# EasyEDA Pro project OSC1.eprj, board CH1/2
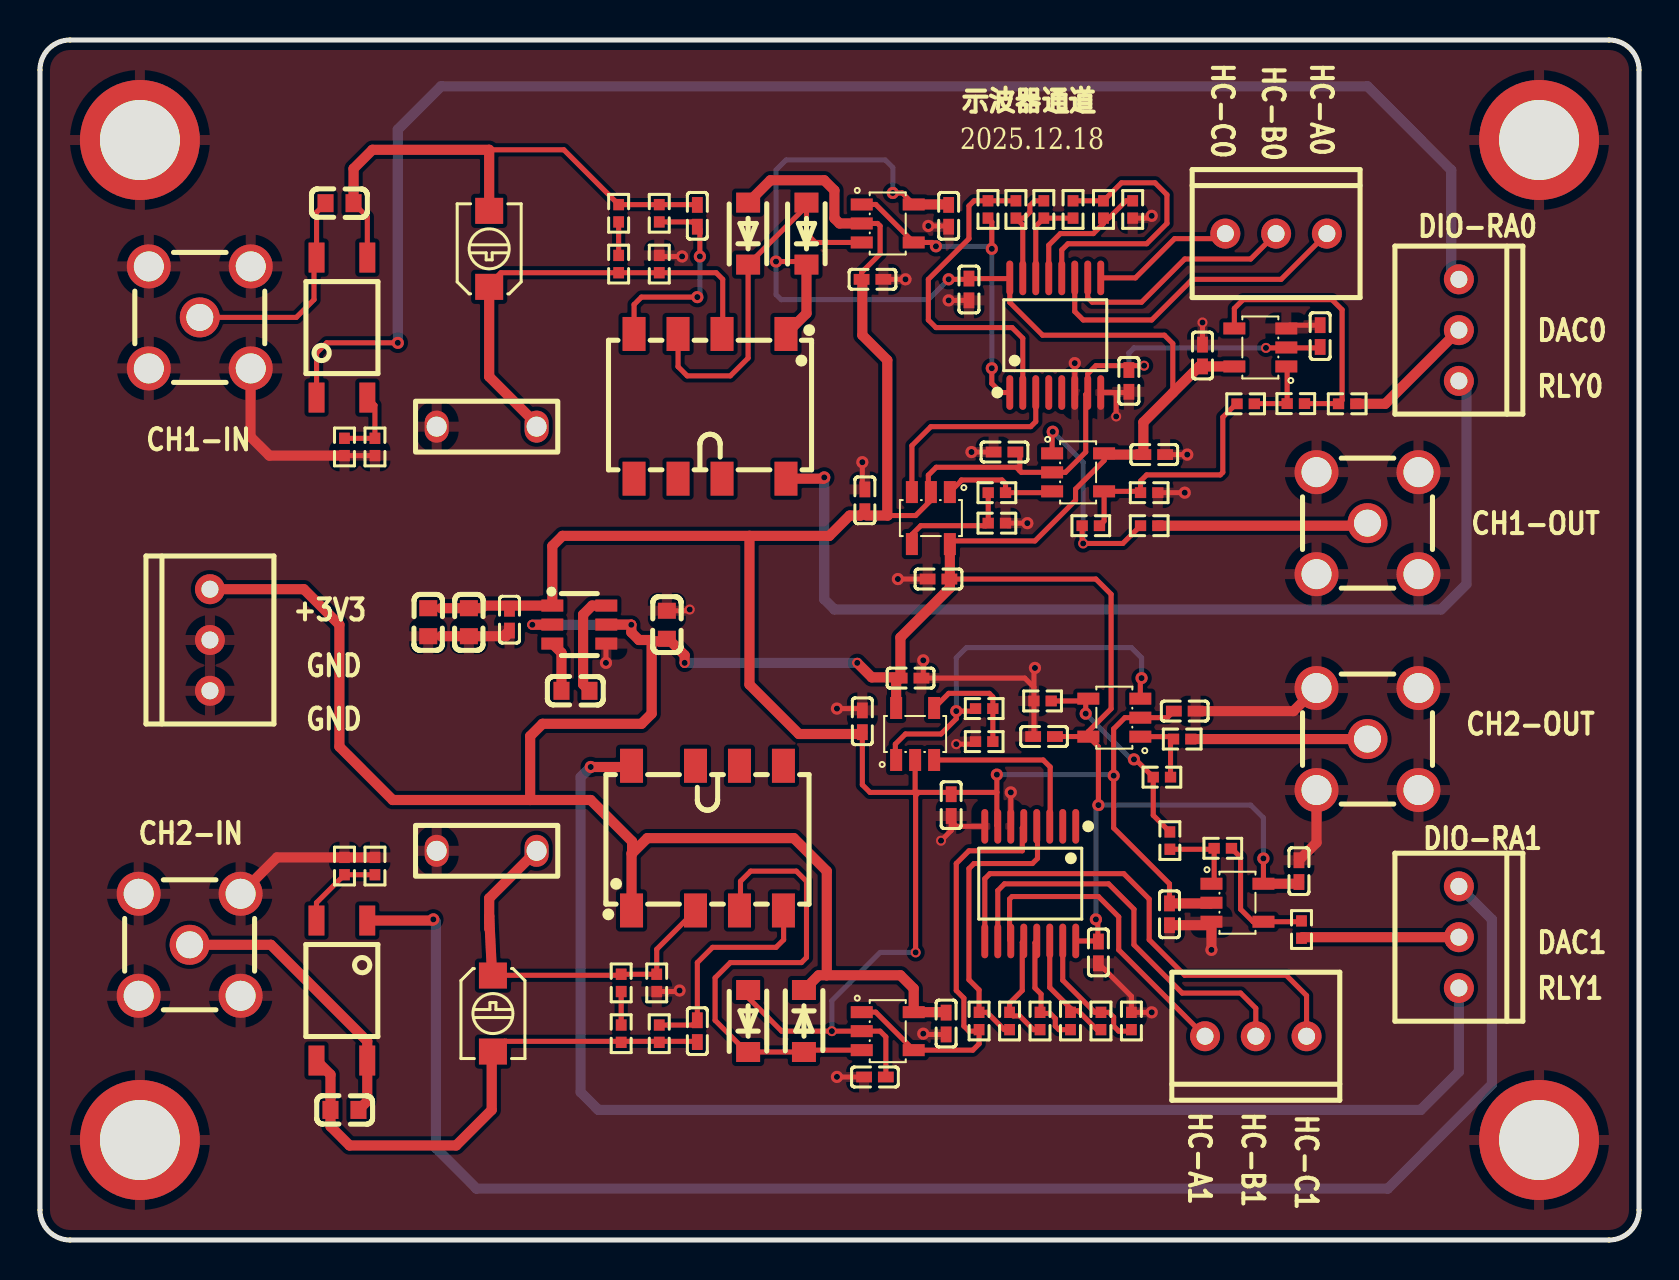
[diagram p11: board, top side]
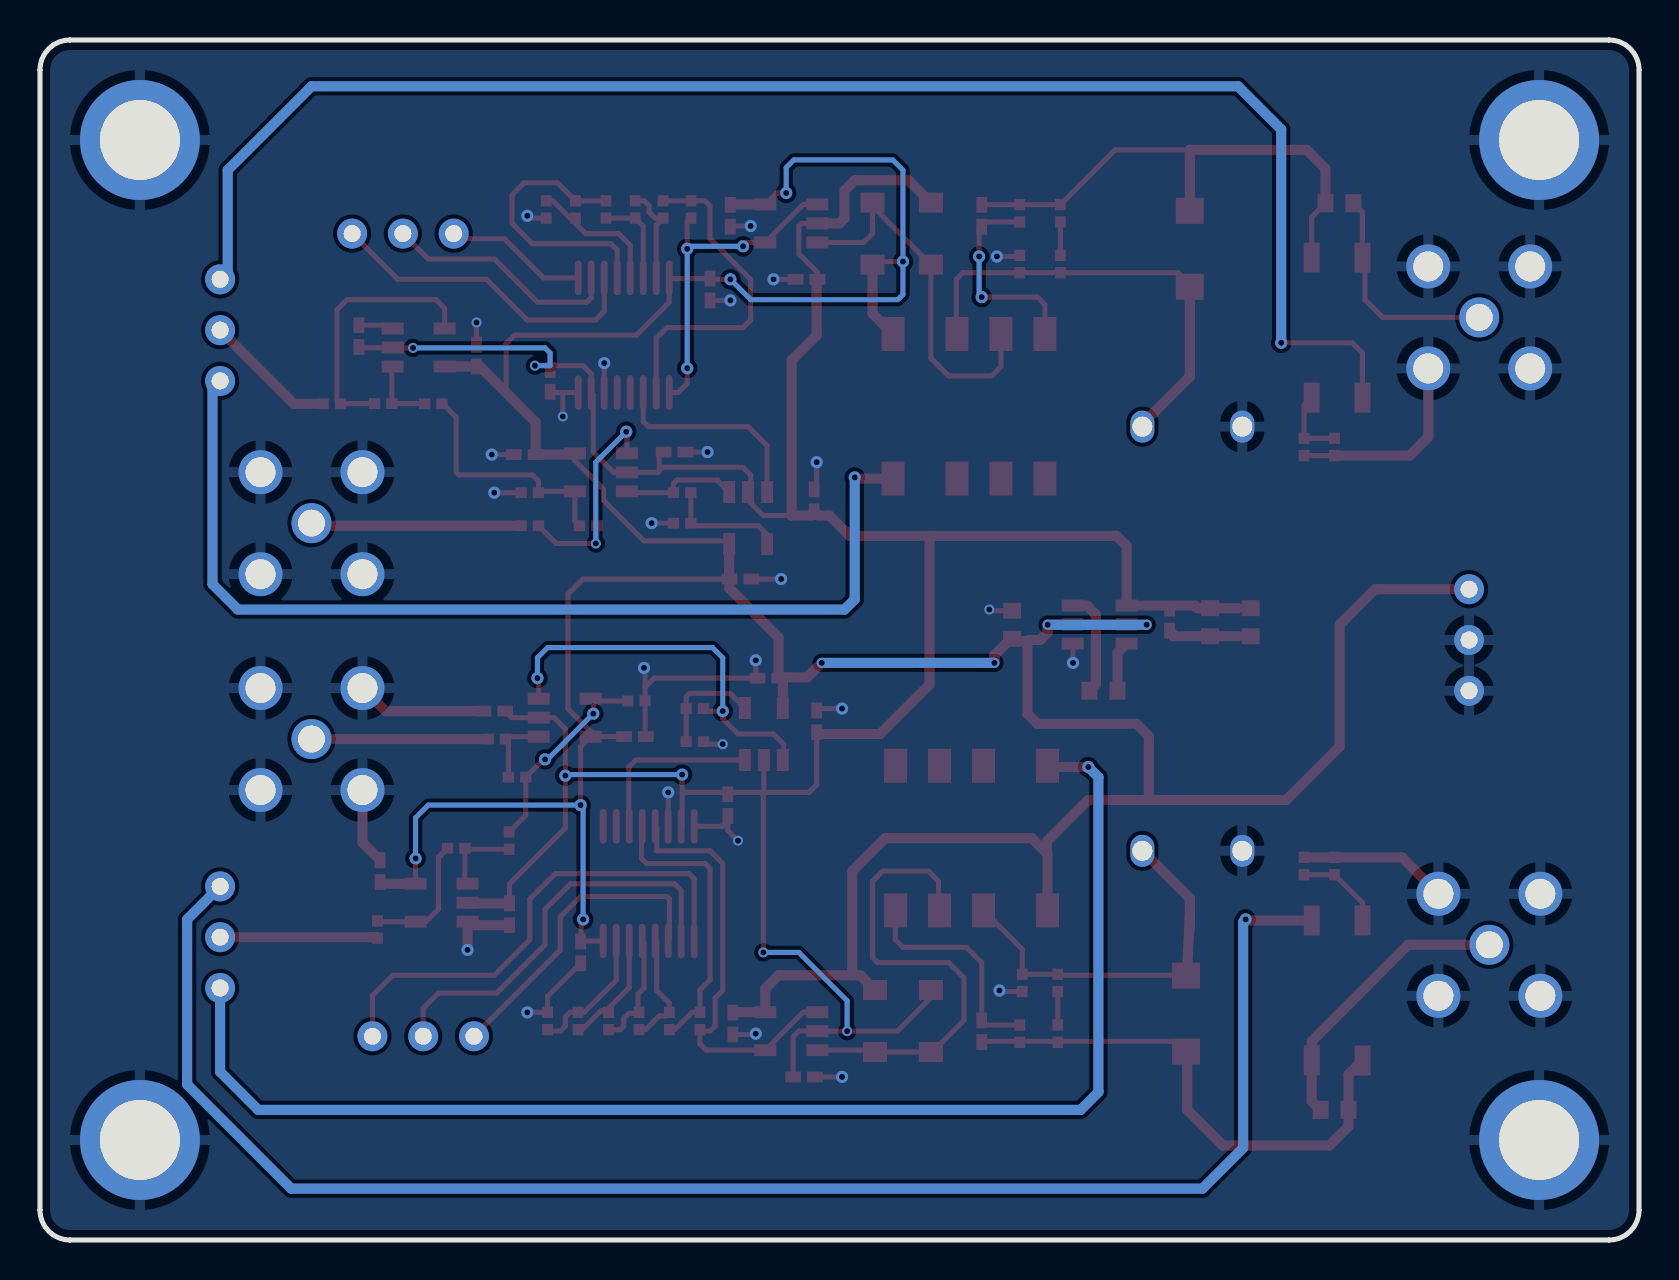
[diagram p12: board, bottom side, seen from below]

Outline 80 x 60 mm; copper layers: Top Layer, Bottom Layer. Coordinates in mm from the lower left corner of the outline.
Outline path: 0,58.5 0,1.5 arc(0.44,0.44) 1.5,0 78.5,0 arc(79.56,0.44) 80,1.5 80,58.5 arc(79.56,59.56) 78.5,60 1.5,60 arc(0.44,59.56) 0,58.5
Stack: Top Layer 0.035mm / Dielectric1 1.51mm FR4 er 4.5 / Bottom Layer 0.035mm

## Design rules (mm)
template: 自定义配置
spacing copperThickness1oz (default): track to track 0.203, other pairs 0.203 to 0.203
spacing copperThickness2oz: track to track 0.203, other pairs 0.152 to 0.3
track width copperThickness1oz (default): min 0.127, default 0.254, max 2.54
track width copperThickness2oz: min 0.203, default 0.254, max 2.54
track width trackWidth1: min 0.254, default 0.762, max 2.54
differential pair differentialPair (default): width min 0.127, default 0.254, max 2.54; gap min 0.152, default 0.152
via viaSize (default): diameter min 0.5, default 0.61, max 10; hole min 0.3, default 0.305, max 6.299

## Placement (name value [footprint] x y rotation side)
C1  22nF  [C0603]  14.99 51.84 0 top
C2  100nF  [C0402]  41.65 48.03 0 top
C3  10nF  [C0402]  32.89 51.21 270 top
C4  120P  [280*100mil]  22.35 40.67 0 top
C5  100nF  [C0402]  45.46 51.21 270 top
C6  100nF  [C0402]  46.48 47.53 90 top
C7  100nF  [C0402]  41.27 36.98 90 top
C8  100nF  [C0402]  48.25 39.4 180 top
C9  100nF  [C0402]  54.48 42.95 90 top
C10  100nF  [C0402]  64.05 45.2 90 top
C11  100nF  [C0402]  44.95 33.05 180 top
C12  100nF  [C0402]  55.75 39.27 0 top
C13  100nF  [C0402]  58.16 44.22 90 top
C14  22nF  [C0603]  15.23 6.5 180 top
C15  100nF  [C0402]  41.77 8.15 180 top
C16  10nF  [C0402]  32.89 10.44 90 top
C17  120P  [280*100mil]  22.35 19.46 0 top
C18  100nF  [C0402]  45.33 10.82 270 top
C19  100nF  [C0402]  52.95 14.38 90 top
C20  100nF  [C0402]  41.14 25.94 90 top
C21  100nF  [C0402]  57.27 26.44 0 top
C22  100nF  [C0402]  45.59 21.74 90 top
C23  100nF  [C0402]  56.51 16.28 270 top
C24  100nF  [C0402]  43.56 28.09 0 top
C25  100nF  [C0402]  50.23 25.17 180 top
C26  100nF  [C0402]  62.99 18.44 90 top
C27  22uF  [C0603]  21.46 30.89 90 top
C28  22uF  [C0603]  19.43 30.89 90 top
C29  22uF  [C0603]  31.36 30.76 270 top
C30  100nF  [C0402]  23.49 31.02 90 top
C31  3.3uF  [C0603]  26.79 27.46 0 top
C32  STC3MA06-T1  [CAP-SMD_L4.5-W3.2_STC3MD20-T1]  22.47 49.56 90 top
C33  STC3MA06-T1  [CAP-SMD_L4.5-W3.2_STC3MD20-T1]  22.66 11.32 270 top
D1  SM4007PL  [SOD-123F_L2.8-W1.8-LS3.7-RD]  35.43 50.32 90 top
D2  SM4007PL  [SOD-123F_L2.8-W1.8-LS3.7-RD]  38.35 50.32 90 top
D3  SM4007PL  [SOD-123F_L2.8-W1.8-LS3.7-RD]  35.43 10.95 90 top
D4  SM4007PL  [SOD-123F_L2.8-W1.8-LS3.7-RD]  38.22 10.95 270 top
J1  -  [CH2.54-3插座]  70.99 45.49 270 top
J2  -  [CH2.54-3插座]  61.84 50.32 0 top
J3  -  [CH2.54-3插座]  70.99 15.14 270 top
J4  -  [CH2.54-3插座]  60.83 10.19 180 top
J5  -  [CH2.54-3插座]  8.5 30 90 top
K1  G6K-2F-Y DC3  [RELAY-SMD_G6K-2F-Y]  33.52 41.68 180 top
K2  G6K-2F-Y DC3  [RELAY-SMD_G6K-2F-Y]  33.4 20.09 0 top
NOREF  -  [Pad_e858]  5 5 0 top
NOREF#2  -  [Pad_e849]  75 55 0 top
NOREF#3  -  [Pad_e1140]  5 55 0 top
NOREF#4  -  [Pad_e850]  75 5 0 top
R1  510kΩ  [R0402]  30.98 51.34 90 top
R2  510kΩ  [R0402]  28.95 51.34 90 top
R3  470kΩ  [R0402]  28.95 48.8 90 top
R4  49.9Ω  [R0402]  47.43 51.53 90 top
R5  24.9Ω  [R0402]  48.83 51.53 270 top
R6  4.99Ω  [R0402]  50.22 51.53 270 top
R7  10Ω  [R0402]  51.68 51.53 90 top
R8  4.99Ω  [R0402]  53.21 51.53 270 top
R9  4.99Ω  [R0402]  54.67 51.53 270 top
R10  20kΩ  [R0402]  30.98 48.8 270 top
R11  1kΩ  [R0402]  15.23 39.65 90 top
R12  1kΩ  [R0402]  16.76 39.65 90 top
R13  22Ω  [R0402]  55.49 35.72 0 top
R14  82Ω  [R0402]  47.87 35.84 180 top
R15  180Ω  [R0402]  47.87 37.37 0 top
R16  180Ω  [R0402]  55.49 37.37 180 top
R17  220Ω  [R0402]  52.57 35.72 180 top
R18  220Ω  [R0402]  60.32 41.81 180 top
R19  220Ω  [R0402]  65.4 41.81 180 top
R20  220Ω  [R0402]  62.83 41.82 180 top
R21  510kΩ  [R0402]  30.98 10.31 270 top
R22  510kΩ  [R0402]  29.08 10.31 270 top
R23  470kΩ  [R0402]  29.08 12.86 270 top
R24  49.9Ω  [R0402]  46.98 10.95 90 top
R25  24.9Ω  [R0402]  48.51 10.95 90 top
R26  4.99Ω  [R0402]  50.03 10.95 90 top
R27  10Ω  [R0402]  51.56 10.95 90 top
R28  4.99Ω  [R0402]  53.08 10.95 90 top
R29  4.99Ω  [R0402]  54.61 10.95 90 top
R30  20kΩ  [R0402]  30.86 12.86 90 top
R31  1kΩ  [R0402]  15.23 18.7 270 top
R32  1kΩ  [R0402]  16.76 18.7 270 top
R33  22Ω  [R0402]  57.14 25.05 0 top
R34  82Ω  [R0402]  47.24 24.92 0 top
R35  180Ω  [R0402]  47.24 26.57 180 top
R36  180Ω  [R0402]  50.16 26.95 0 top
R37  220Ω  [R0402]  56.13 23.14 0 top
R38  220Ω  [R0402]  56.53 19.97 90 top
R39  220Ω  [R0402]  63.11 15.52 90 top
R40  220Ω  [R0402]  59.18 19.59 180 top
RF1  BWSMA-KE-Z001  [SMA-TH_BWSMA-KE-Z001]  8 46.13 0 top
RF2  BWSMA-KE-Z001  [SMA-TH_BWSMA-KE-Z001]  66.42 35.84 180 top
RF3  BWSMA-KE-Z001  [SMA-TH_BWSMA-KE-Z001]  7.49 14.76 0 top
RF4  BWSMA-KE-Z001  [SMA-TH_BWSMA-KE-Z001]  66.42 25.05 0 top
U2  TLP172GM(TPL,E(O  [SMD-4_L4.6-W3.7-P2.54-LS7.0-BR]  15.11 45.62 270 top
U3  GS8091-TR  [SOT-23-5_L3.0-W1.7-P0.95-LS2.8-BR]  42.41 50.83 180 top
U4  74HC4051PW,118  [TSSOP-16_L5.0-W4.4-P0.65-LS6.4-BL]  50.8 45.24 0 top
U5  GS8091-TR  [SOT-23-5_L3.0-W1.7-P0.95-LS2.8-BR]  44.57 36.1 90 top
U6  GS8091-TR  [SOT-23-5_L3.0-W1.7-P0.95-LS2.8-BR]  51.94 38.38 180 top
U7  GS8091-TR  [SOT-23-5_L3.0-W1.7-P0.95-LS2.8-BR]  61.05 44.63 0 top
U9  TLP172GM(TPL,E(O  [SMD-4_L4.6-W3.7-P2.54-LS7.0-BR]  15.1 12.47 90 top
U10  GS8091-TR  [SOT-23-5_L3.0-W1.7-P0.95-LS2.8-BR]  42.41 10.44 180 top
U11  74HC4051PW,118  [TSSOP-16_L5.0-W4.4-P0.65-LS6.4-BL]  49.54 17.82 180 top
U12  GS8091-TR  [SOT-23-5_L3.0-W1.7-P0.95-LS2.8-BR]  43.78 25.3 270 top
U13  GS8091-TR  [SOT-23-5_L3.0-W1.7-P0.95-LS2.8-BR]  53.75 26.12 0 top
U14  GS8091-TR  [SOT-23-5_L3.0-W1.7-P0.95-LS2.8-BR]  59.91 16.86 180 top
U15  SGM3204YN6G/TR  [SOT-23-6_L2.9-W1.6-P0.95-LS2.8-BR]  26.98 30.77 180 top

## Footprints (pads in the part's own frame, mm; a bottom-side part is the same pattern mirrored in y, then rotated)
280*100mil
  oval 1.2x1.6 hole 1x0.8: 1(-2.5,0) 2(2.5,0)
C0402
  rect 0.79x0.54 smd: 1(-0.545,0) 2(0.545,0)
C0603
  rect 0.8x0.9 smd: 1(-0.7,0) 2(0.7,0)
CAP-SMD_L4.5-W3.2_STC3MD20-T1
  rect 1.3x1.4 smd: 1(-1.9,0) 2(1.9,0)
CH2.54-3插座
  round 1.5 hole 0.85: 1(-2.54,0) 2(0,0) 3(2.54,0)
Pad_e849
  round 6 hole 4: 2(0,0)
Pad_e850
  round 6 hole 4: 4(0,0)
Pad_e858
  round 6 hole 4: 3(0,0)
Pad_e1140
  round 6 hole 4: 1(0,0)
R0402
  rect 0.566x0.54 smd: 1(-0.433,0) 2(0.433,0)
RELAY-SMD_G6K-2F-Y
  rect 1.15x1.7 smd: 1(-3.8,-3.618) 2(-0.6,-3.618) 3(1.6,-3.618) 4(3.8,-3.618) 5(3.8,3.618) 6(1.6,3.618) 7(-0.6,3.618) 8(-3.8,3.618)
SMA-TH_BWSMA-KE-Z001
  round 2.2 hole 1.5: 1(-2.55,-2.55) 2(-2.55,2.55) 3(2.55,2.55) 4(2.55,-2.55)
  round 2 hole 1.35: 5(0,0)
SMD-4_L4.6-W3.7-P2.54-LS7.0-BR
  rect 1.5x0.8 smd: 1(3.5,-1.27) 2(3.5,1.27) 3(-3.5,1.27) 4(-3.5,-1.27)
SOD-123F_L2.8-W1.8-LS3.7-RD
  rect 1x1.2 smd: 1(-1.55,0) 2(1.55,0)
SOT-23-5_L3.0-W1.7-P0.95-LS2.8-BR
  rect 1.1x0.6 smd: 1(1.3,-0.95) 2(1.3,0) 3(1.3,0.95) 4(-1.3,0.95) 5(-1.3,-0.95)
SOT-23-6_L2.9-W1.6-P0.95-LS2.8-BR
  rect 1.1x0.6 smd: 1(1.35,-0.95) 2(1.35,0) 3(1.35,0.95) 4(-1.35,0.95) 5(-1.35,0) 6(-1.35,-0.95)
TSSOP-16_L5.0-W4.4-P0.65-LS6.4-BL
  oval 0.343x1.732 smd: 1(-2.275,-2.866) 2(-1.625,-2.866) 3(-0.975,-2.866) 4(-0.325,-2.866) 5(0.325,-2.866) 6(0.975,-2.866) 7(1.625,-2.866) 8(2.275,-2.866) 9(2.275,2.866) 10(1.625,2.866) 11(0.975,2.866) 12(0.325,2.866) 13(-0.325,2.866) 14(-0.975,2.866) 15(-1.625,2.866) 16(-2.275,2.866)

## Nets
As in the schematic, except:
GND: C2.2 C4.1 C5.2 C6.1 C7.2 C8.2 C9.1 C10.2 C11.2 C12.2 C13.2 C15.2 C17.1 C18.2 C19.1 C20.2 C21.2 C22.1 C23.2 C24.2 C25.2 C26.2 C27.1 C28.1 C29.1 C30.1 J5.1 J5.2 NOREF.3 NOREF#2.2 NOREF#3.1 NOREF#4.4 R9.2 R10.1 R11.1 R12.1 R14.1 R16.1 R29.2 R30.1 R31.1 R32.1 R34.1 R36.1 RF1.1 RF1.2 RF1.3 RF1.4 RF2.1 RF2.2 RF2.3 RF2.4 RF3.1 RF3.2 RF3.3 RF3.4 RF4.1 RF4.2 RF4.3 RF4.4 U4.6 U4.8 U7.3 U11.6 U11.8 U14.3 U15.4
INPUT1: C1.1 RF1.5 U2.4
INPUT2: C14.1 RF3.5 U9.4

Pads without a net: K1 5 6 7; K2 5 6 7; U4 4 5; U11 1 2

## Via types
v1: diameter 0.61, hole 0.305, Top Layer to Bottom Layer, 44 vias
v2: diameter 0.5, hole 0.305, Top Layer to Bottom Layer, 13 vias
v3: diameter 0.51, hole 0.305, Top Layer to Bottom Layer, 1 via

## Routing (per net, layer and track width the routed paths; a pad name or vN(x,y) marks a point on that pad's centre or on a via; arc(x,y) is an arc through that point)
+3V3: length 212.9
  Top Layer w0.254: 45.52,33.05 52.83,33.05 53.59,32.29 53.59,26.56 52.45,25.42 U13.5 ; U14.5 61.21,19.08 ; v1(45.46,48.03) 46.44,48.03 C6.2 48.49,48.07 U4.16 48.52,46.88 50.16,45.24 56.26,45.24 56.68,44.82 56.68,42.36 ; 30.54,30 30.6,30.06 ; v1(42.67,52.35) 43.14,52.35 U3.5 ; 51.82,14.95 52.93,14.95 ; 52.93,14.95 C19.2 ; 52.93,14.95 52.93,15.93 v1(52.83,16.03) ; U13.5 52.44,25.17 C25.1 ; U13.5 52.95,24.66 v1(52.95,21.74) ; v1(36.83,48.92) 38.2,48.92 D2.1 ; v2(24.63,30.76) 24.62,30.77 24.52,30.77 ; U5.5 45.68,34.95 49.78,34.95 51.81,36.98 51.81,37.55 53.24,38.97 U6.5
  Top Layer w0.508: U14.5 62.9,17.81 C26.1 ; 39.36,13.24 43.05,13.24 43.71,12.57 U10.5 45.31,11.39 C18.1 ; 39.36,13.24 39.36,13.24 39.36,18.44 37.71,20.09 30.39,20.09 29.62,19.33 ; 39.36,13.24 38.96,13.24 D4.1 ; U15.2 25.62,30.76 v2(24.63,30.76) ; 24.52,22 17.65,22 14.98,24.67 14.98,30.76 13.2,32.54 J5.3 ; 24.52,22 24.52,25.19 25.14,25.81 30.09,25.81 30.6,26.32 30.6,29.94 ; 24.52,22 27.55,22 29.62,19.93 29.62,19.33 ; 30.6,29.94 31.55,29.94 32.25,29.24 v2(32.25,28.86) ; 30.6,29.94 30.54,30 29.97,30 29.59,30.38 v2(29.59,30.76) 29.58,30.77 U15.5 ; D2.1 38.35,46.33 K1.1 ; C11.1 45.52,33.07 ; 45.52,33.07 45.52,32.6 43.05,30.13 43.05,28.13 ; 45.52,33.07 U5.5 ; 29.62,19.33 29.6,19.33 K2.1 ; U12.5 42.83,27.92 C24.1 43.05,28.13 ; U6.5 53.3,39.27 C12.1 55.2,40.88 58,43.68 C13.1 59.75,43.68 U7.5 ; v2(40.89,28.86) 41.61,28.13 43.05,28.13 ; C5.1 45.44,51.78 U3.5
  Bottom Layer w0.254: v1(45.46,48.03) 44.45,47.02 37.08,47.02 36.83,47.27 v1(36.83,48.92) 36.83,53.49 37.33,54 42.29,54 42.67,53.62 v1(42.67,52.35) ; v1(52.83,16.03) 52.83,21.62 v1(52.95,21.74) 60.57,21.74 61.21,21.11 v1(61.21,19.08)
  Bottom Layer w0.508: v2(40.89,28.86) v2(32.25,28.86) ; v2(29.59,30.76) v2(24.63,30.76)
-3V3: length 156.1
  Top Layer w0.254: U3.2 41.9,50.83 42.03,50.7 42.03,49.3 41.11,48.38 C2.1 ; 47.87,22.38 45.68,22.38 ; 47.87,22.38 v1(47.87,23.27) ; 47.87,22.38 47.87,20.73 U11.7 ; 49.02,38.46 48.84,38.64 44.84,38.64 44.45,38.24 44.45,37.52 U5.2 44.57,36.98 43.81,36.22 42.41,36.22 ; 49.02,38.46 49.02,39.4 C8.1 ; 49.02,38.46 49.1,38.38 U6.2 51.3,38.38 52.32,39.4 52.32,42.27 U4.7 52.42,43.31 52.83,43.72 54.39,43.72 ; 43.73,22.38 43.78,22.43 U12.2 ; 43.73,22.38 41.52,22.38 41.14,22.76 C20.1 ; 43.73,22.38 43.96,22.38 ; v2(43.81,14.38) 43.81,22.23 43.96,22.38 ; v2(61.34,44.61) 64,44.61 C10.1 ; C15.1 42.32,10.16 42.03,10.44 U10.2 v2(39.62,10.44) 37.11,10.44 35.05,12.5 ; C21.1 56.4,26.12 U13.2 54.28,26.12 53.72,25.55 v1(53.72,23.22) 53.72,20.6 56.51,17.81 C23.1 ; 45.5,22.38 43.96,22.38 ; 54.39,43.72 54.61,43.5 ; 54.39,43.72 v2(55.24,43.72)
  Top Layer w0.508: C23.1 58.58,16.83 U14.2 ; C2.1 41.14,48 41.14,45.24 42.39,43.99 42.39,36.24 42.41,36.22 41.36,36.22 ; 20.06,31.59 C27.2 22.09,31.59 22.23,31.72 U15.1 25.63,34.7 26.14,35.21 35.5,35.21 ; U3.2 40,50.83 39.75,51.08 39.75,52.48 39.24,52.99 36.55,52.99 D1.2 ; 35.5,35.21 39.49,35.21 40.51,36.22 41.05,36.22 C7.1 ; 35.5,35.21 35.5,27.77 37.97,25.3 41.05,25.3 C20.1
  Bottom Layer w0.254: v2(61.34,44.61) 54.73,44.61 54.48,44.35 54.48,43.72 v2(55.24,43.72) ; v2(39.62,10.44) 39.62,11.97 42.03,14.38 v2(43.81,14.38) ; v1(53.72,23.22) 53.67,23.27 v1(47.87,23.27)
GND: length 82.1
  Top Layer w0.254: v1(43.3,48.03) C2.2 ; 54.61,42.41 54.57,42.37 53.75,42.37 ; U4.6 v1(51.77,43.84) ; C12.2 v1(57.4,39.27) ; C20.2 41.05,26.57 v1(39.87,26.57) ; 53.75,42.37 53.84,42.28 v2(53.84,41.18) ; 53.75,42.37 U4.8 ; C22.1 45.59,20.95 ; 45.59,20.95 45.59,20.47 v2(45.08,19.97) ; 45.59,20.95 45.85,20.68 47.27,20.68 ; v1(32.13,49.18) 31.03,49.18 R10.1 ; 57.27,37.49 57.14,37.37 R16.1 ; U7.3 62.52,45.74 C10.2 ; v2(32.51,31.52) 32.45,31.46 C29.1 ; 49.73,27.64 49.73,28.55 v1(49.78,28.6) ; 49.73,27.64 49.27,28.09 C24.2 44.19,28.19 v1(44.19,28.98) ; 49.73,27.64 R36.1 49.73,25.21 C25.2 ; v3(45.84,24.79) 46.68,24.79 ; U11.6 v1(48.57,22.38) ; v1(55.62,51.21) 55.51,51.09 R9.2 ; v1(28.32,28.86) 28.32,29.79 28.28,29.82 ; 41.14,37.53 v1(41.14,38.89) ; C18.2 44.32,10.28 ; R11.1 R12.1 ; v1(39.87,8.16) 39.88,8.15 C15.2 ; R30.1 31.87,12.42 ; C13.2 v2(58.16,45.88) ; C5.2 45.42,50.7 v1(44.45,50.7) ; v1(55.62,11.38) R29.2 54.61,12.18 C19.1 ; R14.1 v1(49.4,35.84) ; C11.2 v1(42.92,33.05) ; C8.2 v1(46.6,39.4) ; C6.1 v1(45.46,46.98)
  Top Layer w0.508: C30.1 23.3,30.28 23.3,30.19 C27.1 20.06,30.19 ; R32.1 R31.1 11.86,19.13 RF3.3 ; C26.2 63.87,19.87 RF4.1 ; RF4.2 62.71,26.44 C21.2 ; C23.2 58.43,15.74 U14.3 v1(58.61,14.51) ; R11.1 11.48,39.22 10.54,40.16 10.54,43.57 RF1.4
  vias: v1(32,12.47) v1(44.19,10.31) v1(57.27,37.37)
CH1-0: length 16.9
  Top Layer w0.254: U3.1 41.81,51.78 U3.4 44.63,49.88 v1(44.83,49.69) ; v1(47.62,43.59) 47.62,42.83 48.07,42.37 U4.1 ; R4.1 47.62,50.9 v1(47.62,49.56)
  Bottom Layer w0.254: v1(47.62,43.59) v1(47.62,49.56) 47.49,49.69 v1(44.83,49.69)
CH1-1: length 16.8
  Top Layer w0.254: U4.2 49.17,45.09 48.64,45.62 44.83,45.62 44.45,46 44.45,48.03 46.48,50.07 46.48,51.7 46.73,51.96 48.83,51.96
CH1-2: length 5.1
  Top Layer w0.254: 50.22,51.96 49.77,51.96 49.52,51.72 49.52,51.39 49.22,51.09 R5.2 49.17,50.75 U4.15
CH1-3: length 4.6
  Top Layer w0.254: R7.1 R6.2 49.82,50.69 U4.14
CH1-4: length 14
  Top Layer w0.254: 51.68,51.96 53.21,51.96 54.11,52.86 55.79,52.86 56.38,52.26 56.38,50.83 55.37,49.81 51.43,49.81 51.12,49.5 U4.12
CH1-5: length 6.9
  Top Layer w0.254: 54.67,51.96 54.34,51.96 53.47,51.09 R8.2 53.21,50.83 52.7,50.32 51.05,50.32 50.47,49.74 U4.13
CH1-OUT: length 10.5
  Top Layer w0.508: R13.2 66.29,35.72 RF2.5
CH2-0: length 21.5
  Top Layer w0.254: U11.5 49.14,20.61 49.14,19.46 46.48,19.46 45.84,18.82 45.84,12.47 46.22,12.09 46.22,10.7 46.48,10.44 46.91,10.44 R24.1 46.98,10.51 46.98,9.81 46.67,9.49 U10.4 41.81,11.39 U10.1
CH2-1: length 14.5
  Top Layer w0.254: 49.91,20.69 49.91,19.08 49.65,18.82 46.73,18.82 46.48,18.57 46.48,13.01 46.98,12.5 R24.2 47.38,11.38 48.25,10.52 R25.1
CH2-2: length 5.7
  Top Layer w0.254: R26.1 49.7,10.52 49.02,11.2 48.69,11.2 R25.2 48.51,11.84 49.14,12.47 49.14,14.88 49.22,14.95
CH2-3: length 5.9
  Top Layer w0.254: R27.1 50.97,10.52 50.8,10.7 50.8,11.08 50.54,11.33 50.08,11.33 ; 50.08,11.33 50.08,12.3 49.78,12.6 49.78,14.86 49.87,14.95 ; 50.08,11.33 R26.2
CH2-4: length 5.9
  Top Layer w0.254: 50.52,14.95 50.52,12.62 51.56,11.59 R27.2 51.63,11.46 51.94,11.46 52.88,10.52 R28.1
CH2-5: length 6.7
  Top Layer w0.254: 51.17,14.95 51.17,12.99 52.78,11.38 R28.2 53.48,11.38 53.72,11.14 53.72,10.7 53.97,10.44 54.53,10.44 R29.1
CH2-OUT: length 8.8
  Top Layer w0.508: R33.2 RF4.5
DAC0: length 6.7
  Top Layer w0.508: J1.2 67.3,41.81 R19.1
DAC1: length 7.9
  Top Layer w0.508: J3.2 63.17,15.14 R39.1
DIO-RA0: length 78.1
  Top Layer w0.254: v1(17.9,44.86) 14.35,44.86 13.84,44.35 U2.1
  Bottom Layer w0.508: v1(17.9,44.86) 17.9,55.53 20.06,57.69 66.42,57.69 70.61,53.49 70.61,48.41 J1.1
DIO-RA1: length 81.2
  Top Layer w0.508: U9.1 19.62,15.97 v1(19.68,16.03)
  Bottom Layer w0.508: v1(19.68,16.03) 19.81,15.9 19.81,4.6 21.84,2.57 67.43,2.57 72.64,7.78 72.64,16.03 J3.1
HC-A0: length 16.3
  Top Layer w0.254: U4.11 51.77,46.42 52.19,46 55.62,46 57.65,48.03 62.1,48.03 J2.3
HC-A1: length 15.8
  Top Layer w0.254: J4.3 53.97,14.51 53.97,16.16 52.95,17.17 48.64,17.17 48.51,17.05 48.51,15.01 48.57,14.95
HC-B0: length 11.9
  Top Layer w0.254: J2.2 60.57,49.05 57.27,49.05 55.11,46.89 52.64,46.89 52.42,47.11 U4.10
HC-B1: length 20.6
  Top Layer w0.254: J4.2 60.83,11.59 60.07,12.35 57.14,12.35 54.73,14.76 54.73,16.54 53.46,17.81 48.25,17.81 47.92,17.47 47.92,14.95
HC-C0: length 7.2
  Top Layer w0.254: J2.1 59.05,50.07 56.76,50.07 54.8,48.11 U4.9
HC-C1: length 25.1
  Top Layer w0.254: 47.27,14.95 47.27,18.06 47.52,18.32 54.22,18.32 55.49,17.05 55.49,15.01 57.27,13.24 62.35,13.24 63.37,12.22 J4.1
INPUT1: length 11.1
  Top Layer w0.254: RF1.5 12.82,46.13 13.71,47.02 13.71,48.99 U2.4 13.84,51.39 C1.1
INPUT2: length 14.5
  Top Layer w0.508: RF3.5 11.55,14.76 16.37,9.94 U9.4 16.37,6.94 C14.1
OUT_HC0: length 10.5
  Top Layer w0.254: U4.3 49.82,40.92 49.57,40.67 44.57,40.67 43.62,39.72 U5.3
OUT_HC1: length 8.9
  Top Layer w0.254: U12.3 50.19,24 50.54,23.65 50.54,20.7 U11.3
RLY0: length 51.2
  Top Layer w0.508: K1.8 39.18,38.07 v1(39.24,38.13)
  Bottom Layer w0.508: v1(39.24,38.13) 39.24,32.03 39.75,31.52 70.1,31.52 71.37,32.79 71.37,42.57 J1.3
RLY1: length 67.8
  Top Layer w0.508: v1(27.55,23.65) 29.53,23.65 K2.8
  Bottom Layer w0.508: J3.3 70.99,8.41 69.08,6.5 27.93,6.5 27.05,7.39 27.05,23.14 v1(27.55,23.65)
$1N1760: length 3.7
  Top Layer w0.254: R11.2 R12.2 16.76,41.74 U2.2
$1N2407: length 23.1
  Top Layer w0.254: 22.47,47.78 23.06,48.36 R3.1 R10.2 33.83,48.36 34.16,48.03 34.16,45.34 K1.2
  Top Layer w0.508: 25.1,40.54 22.47,43.17 22.47,47.78
$1N11061: length 19
  Top Layer w0.254: K1.3 31.92,43.66 32.38,43.21 34.54,43.21 35.43,44.1 D1.1 38.35,51.69 ; U3.3 38.79,49.88 38.35,50.32 38.35,51.69 ; 38.35,51.69 D2.2
$1N11884: length 5.9
  Top Layer w0.254: U5.1 46.1,37.97 46.1,38 48.13,38 48.31,37.82 R15.2 50.57,37.37 U6.3
$1N12026: length 11.5
  Top Layer w0.254: v1(50.67,40.41) 50.64,40.38 U6.1 ; 55.06,35.72 54.17,34.83 v2(52.19,34.83) 52.14,34.88 R17.2
  Bottom Layer w0.254: v1(50.67,40.41) 52.19,38.89 v2(52.19,34.83)
$1N12901: length 6.1
  Top Layer w0.254: U5.4 43.62,35.27 44.06,35.72 47.31,35.72 47.44,35.84 47.44,37.37
$1N12908: length 12.3
  Top Layer w0.254: R17.1 53.24,35.95 U6.4 54.99,37.43 55.06,37.37 55.06,37.95 55.37,38.25 59.05,38.25 59.18,38.38 59.18,41.14 59.86,41.82
$1N20167: length 26.5
  Top Layer w0.254: C1.2 16.38,51.15 U2.3 ; 22.47,54.51 26.21,54.51 R2.2 R1.2 32.87,51.77 C3.1
  Top Layer w0.508: C1.2 15.69,53.57 16.63,54.51 22.47,54.51 C32.2
$1N20346: length 1.7
  Top Layer w0.254: R3.2 R2.1
$1N20539: length 10.4
  Top Layer w0.254: v1(32.89,47.14) 30.09,47.14 29.72,46.77 K1.4 ; R1.1 32.65,50.9 C3.2 33.02,50.54 v1(33.02,49.18)
  Bottom Layer w0.254: v1(32.89,47.14) 33.02,47.27 v1(33.02,49.18)
$1N22217: length 13.3
  Top Layer w0.254: U7.4 59.75,46.58 60.19,47.02 64.64,47.02 65.15,46.51 65.15,41.99 R19.2 64.96,41.82 R20.1
$1N22283: length 3.5
  Top Layer w0.254: 60.72,41.82 R20.2 62.4,43.63 U7.1
$6N4438: length 4.4
  Top Layer w0.254: R32.2 R31.2 13.83,16.86 U9.2
$6N4445: length 19.9
  Top Layer w0.254: 22.6,13.62 22.98,13.24 29.03,13.24 29.08,13.29 30.86,13.29 30.86,14.54 K2.2
  Top Layer w0.508: 22.47,16.2 22.47,17.09 C17.2 ; 22.47,16.2 22.47,15.57 ; 22.47,16.2 22.6,13.62
$6N4470: length 24.5
  Top Layer w0.254: U10.3 38.31,9.49 D4.2 35.36,9.4 ; 35.36,9.4 33.78,10.98 33.78,13.11 34.54,13.87 38.09,13.87 38.35,14.12 38.35,17.94 37.84,18.44 35.55,18.44 35.05,17.94 35.05,16.53 K2.3 ; 35.36,9.4 35.05,9.4
$6N4490: length 20.2
  Top Layer w0.254: 46.81,26.44 v1(45.84,26.44) 45.84,26.06 45.08,25.3 43.3,25.3 42.79,24.79 42.79,24.04 U12.1 ; U13.3 55.05,28.03 v1(55.11,28.09)
  Bottom Layer w0.254: v1(55.11,28.09) 55.11,29.11 54.61,29.62 46.35,29.62 45.84,29.11 v1(45.84,26.44)
$6N4491: length 3.7
  Top Layer w0.254: R37.2 56.56,24.9 R33.1 56.59,25.17 U13.1
$6N4495: length 5.5
  Top Layer w0.254: R34.2 R35.1 47.67,27.15 47.49,27.33 45.47,27.33 U12.4
$6N4496: length 10.3
  Top Layer w0.254: R38.2 55.7,21.24 R37.1 54.81,24.03 v1(54.73,24.03) ; v1(52.32,26.32) 52.32,26.94 52.33,26.95 ; 52.33,26.95 U13.4 ; 52.33,26.95 R36.2
  Bottom Layer w0.254: v1(54.73,24.03) 54.61,24.03 v1(52.32,26.32)
$6N4497: length 26.1
  Top Layer w0.254: C16.1 32.85,9.93 23.24,9.93 22.6,9.3 22.6,8.92
  Top Layer w0.508: 22.6,8.92 22.6,6.5 20.82,4.73 15.49,4.73 14.53,5.68 C14.2 14.53,8.27 U9.3
$6N4505: length 1.7
  Top Layer w0.254: 29.08,10.75 R23.2
$6N4507: length 11.1
  Top Layer w0.254: 30.98,10.75 32.65,10.75 C16.2 32.89,13.87 33.65,14.63 36.83,14.63 37.21,15.01 37.21,16.47 K2.4
$6N4545: length 6.6
  Top Layer w0.254: R39.2 63.07,15.91 U14.4 60.69,15.91 60.07,16.54 60.07,19.13 R40.1
$6N4553: length 4.1
  Top Layer w0.254: U14.1 58.74,17.95 R40.2 58.7,19.54 R38.1
$7N1925: length 2.6
  Top Layer w0.508: C31.1 26.09,29.36 U15.3
$7N1932: length 5.3
  Top Layer w0.508: C31.2 27.17,27.78 27.17,31.27 27.62,31.72 U15.6

## Copper pours and planes (outline as drawn; the poured copper is in the pictures)
GND on Top Layer: -4.7,62.38 82.42,62.38 82.42,-2.64 -4.7,-2.64
GND on Bottom Layer: -5.59,61.62 81.66,61.62 81.66,-2.13 -5.59,-2.13

## Text on the board
Top Silkscreen Layer: CH2-IN | CH1-IN | +3V3 | GND | CH2-OUT | CH1-OUT | HC-A1 | HC-C0 | HC-B1 | HC-B0 | HC-C1 | HC-A0 | DIO-RA0 | DIO-RA1 | DAC0 | RLY0 | DAC1 | RLY1 | 示波器通道 | 2025.12.18
